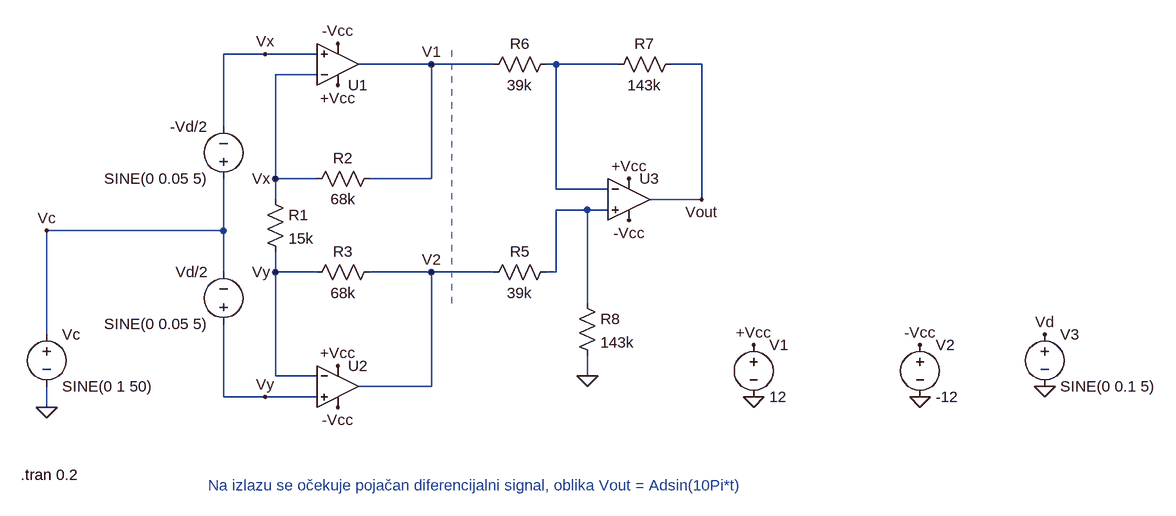
[diagram p0: schematic Zadatak1.asc]
Zadatak1.asc, the LTspice schematic file:
Version 4.1
SHEET 1 1880 708
WIRE 64 -64 0 -64
WIRE 144 -64 64 -64
WIRE 320 -48 208 -48
WIRE 416 -48 320 -48
WIRE 512 -48 496 -48
WIRE 608 -48 512 -48
WIRE 736 -48 688 -48
WIRE 144 -32 80 -32
WIRE 0 48 0 -64
WIRE 80 128 80 -32
WIRE 144 128 80 128
WIRE 320 128 320 -48
WIRE 320 128 224 128
WIRE 512 144 512 -48
WIRE 592 144 512 144
WIRE 80 160 80 128
WIRE 736 160 736 -48
WIRE 736 160 656 160
WIRE 560 176 512 176
WIRE 592 176 560 176
WIRE 0 208 0 128
WIRE 0 208 -272 208
WIRE 0 272 0 208
WIRE 80 272 80 240
WIRE 144 272 80 272
WIRE 320 272 224 272
WIRE 416 272 320 272
WIRE 512 272 512 176
WIRE 512 272 496 272
WIRE 560 320 560 176
WIRE -272 368 -272 208
WIRE 80 432 80 272
WIRE 144 432 80 432
WIRE 560 432 560 400
WIRE 320 448 320 272
WIRE 320 448 208 448
WIRE 0 464 0 352
WIRE 64 464 0 464
WIRE 144 464 64 464
WIRE -272 480 -272 448
FLAG 816 464 0
FLAG 816 384 +Vcc
FLAG 1072 384 -Vcc
FLAG 1072 464 0
FLAG 176 416 +Vcc
FLAG 176 -80 -Vcc
FLAG 624 128 +Vcc
FLAG 624 192 -Vcc
FLAG 176 480 -Vcc
FLAG 176 -16 +Vcc
FLAG -272 480 0
FLAG 736 160 Vout
FLAG 320 -48 V1
FLAG 320 272 V2
FLAG 64 -64 Vx
FLAG 80 128 Vx
FLAG 80 272 Vy
FLAG 64 464 Vy
FLAG 560 432 0
FLAG -272 208 Vc
FLAG 1264 448 0
FLAG 1264 368 Vd
SYMBOL OpAmps\\UniversalOpAmp2 176 448 R0
SYMATTR InstName U2
SYMBOL OpAmps\\UniversalOpAmp2 624 160 R0
SYMATTR InstName U3
SYMBOL OpAmps\\UniversalOpAmp2 176 -48 M180
SYMATTR InstName U1
SYMBOL voltage 816 368 R0
SYMATTR InstName V1
SYMATTR Value 12
SYMBOL voltage 1072 368 R0
SYMATTR InstName V2
SYMATTR Value -12
SYMBOL voltage -272 352 R0
WINDOW 123 0 0 Left 0
WINDOW 39 0 0 Left 0
SYMATTR InstName Vc
SYMATTR Value SINE(0 1 50)
SYMBOL voltage 0 368 R180
WINDOW 0 24 96 Left 2
WINDOW 3 24 16 Left 2
WINDOW 123 0 0 Left 0
WINDOW 39 0 0 Left 0
SYMATTR InstName Vd/2
SYMATTR Value SINE(0 0.05 5)
SYMBOL voltage 0 144 R180
WINDOW 0 24 96 Left 2
WINDOW 3 24 16 Left 2
SYMATTR InstName -Vd/2
SYMATTR Value SINE(0 0.05 5)
SYMBOL res 64 144 R0
SYMATTR InstName R1
SYMATTR Value 15k
SYMBOL res 240 112 R90
WINDOW 0 0 56 VBottom 2
WINDOW 3 32 56 VTop 2
SYMATTR InstName R2
SYMATTR Value 68k
SYMBOL res 240 256 R90
WINDOW 0 0 56 VBottom 2
WINDOW 3 32 56 VTop 2
SYMATTR InstName R3
SYMATTR Value 68k
SYMBOL res 512 -64 R90
WINDOW 0 0 56 VBottom 2
WINDOW 3 32 56 VTop 2
SYMATTR InstName R6
SYMATTR Value 39k
SYMBOL res 512 256 R90
WINDOW 0 0 56 VBottom 2
WINDOW 3 32 56 VTop 2
SYMATTR InstName R5
SYMATTR Value 39k
SYMBOL res 704 -64 R90
WINDOW 0 0 56 VBottom 2
WINDOW 3 32 56 VTop 2
SYMATTR InstName R7
SYMATTR Value 143k
SYMBOL res 544 304 R0
SYMATTR InstName R8
SYMATTR Value 143k
SYMBOL voltage 1264 352 R0
SYMATTR InstName V3
SYMATTR Value SINE(0 0.1 5)
TEXT -24 600 Left 2 ;Na izlazu se očekuje pojačan diferencijalni signal, oblika Vout = Adsin(10Pi*t)
TEXT -312 584 Left 2 !.tran 0.2
LINE Normal 352 320 352 -80 1

The netlist it stands for:
* Zadatak1.asc
X§U2 Vy Vy +Vcc -Vcc V2 level2 Avol=1Meg GBW=10Meg Slew=10Meg Ilimit=25m Rail=0 Vos=0 En=0 Enk=0 In=0 Ink=0 Rin=500Meg  ; pins In+ In- V+ V- OUT
X§U3 N002 N001 +Vcc -Vcc Vout level2 Avol=1Meg GBW=10Meg Slew=10Meg Ilimit=25m Rail=0 Vos=0 En=0 Enk=0 In=0 Ink=0 Rin=500Meg  ; pins In+ In- V+ V- OUT
X§U1 Vx Vx +Vcc -Vcc V1 level2 Avol=1Meg GBW=10Meg Slew=10Meg Ilimit=25m Rail=0 Vos=0 En=0 Enk=0 In=0 Ink=0 Rin=500Meg  ; pins In+ In- V+ V- OUT
V1 +Vcc 0 12
V2 -Vcc 0 -12
Vc Vc 0 SINE(0 1 50)
Vd/2 Vy Vc SINE(0 0.05 5)
V§-Vd/2 Vc Vx SINE(0 0.05 5)
R1 Vx Vy 15k
R2 V1 Vx 68k
R3 V2 Vy 68k
R6 N001 V1 39k
R5 N002 V2 39k
R7 Vout N001 143k
R8 N002 0 143k
V3 Vd 0 SINE(0 0.1 5)
* Na izlazu se očekuje pojačan diferencijalni signal, oblika Vout = Adsin(10Pi*t)
.tran 0.2
.lib UniversalOpAmp2.lib
.backanno
.end

* Results of the author's LTspice run, read from the files saved beside the schematic
* Operating Point, zero values left out:
*   V(+vcc) = 12 V
*   V(-vcc) = -12 V
*   I(V1) = -3.597 mA
*   I(V2) = 3.597 mA
*   Ix(u1:3) = 1.199 mA
*   Ix(u1:4) = -1.199 mA
*   Ix(u2:3) = 1.199 mA
*   Ix(u2:4) = -1.199 mA
*   Ix(u3:3) = 1.199 mA
*   Ix(u3:4) = -1.199 mA
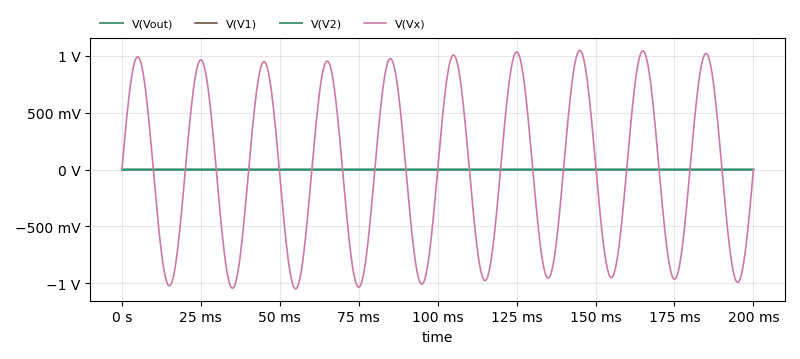
[diagram p1: Transient Analysis of Zadatak1.asc, plotted from the saved traces]
* Transient Analysis, 1 run:
*   V(Vout): min -51.09 µV, max 51.09 µV, average 0 V, rms 36.13 µV, last -119.3 pV
*   V(V1): min -146.2 µV, max 146.2 µV, average 0 V, rms 98.67 µV, last 0 V
*   V(V2): min -146.2 µV, max 146.2 µV, average 0 V, rms 98.67 µV, last 0 V
*   V(Vx): min -1.049 V, max 1.049 V, average 0 V, rms 708 mV, last 0 V